# Altium project UperMachine_PCB_Project.PrjPcb
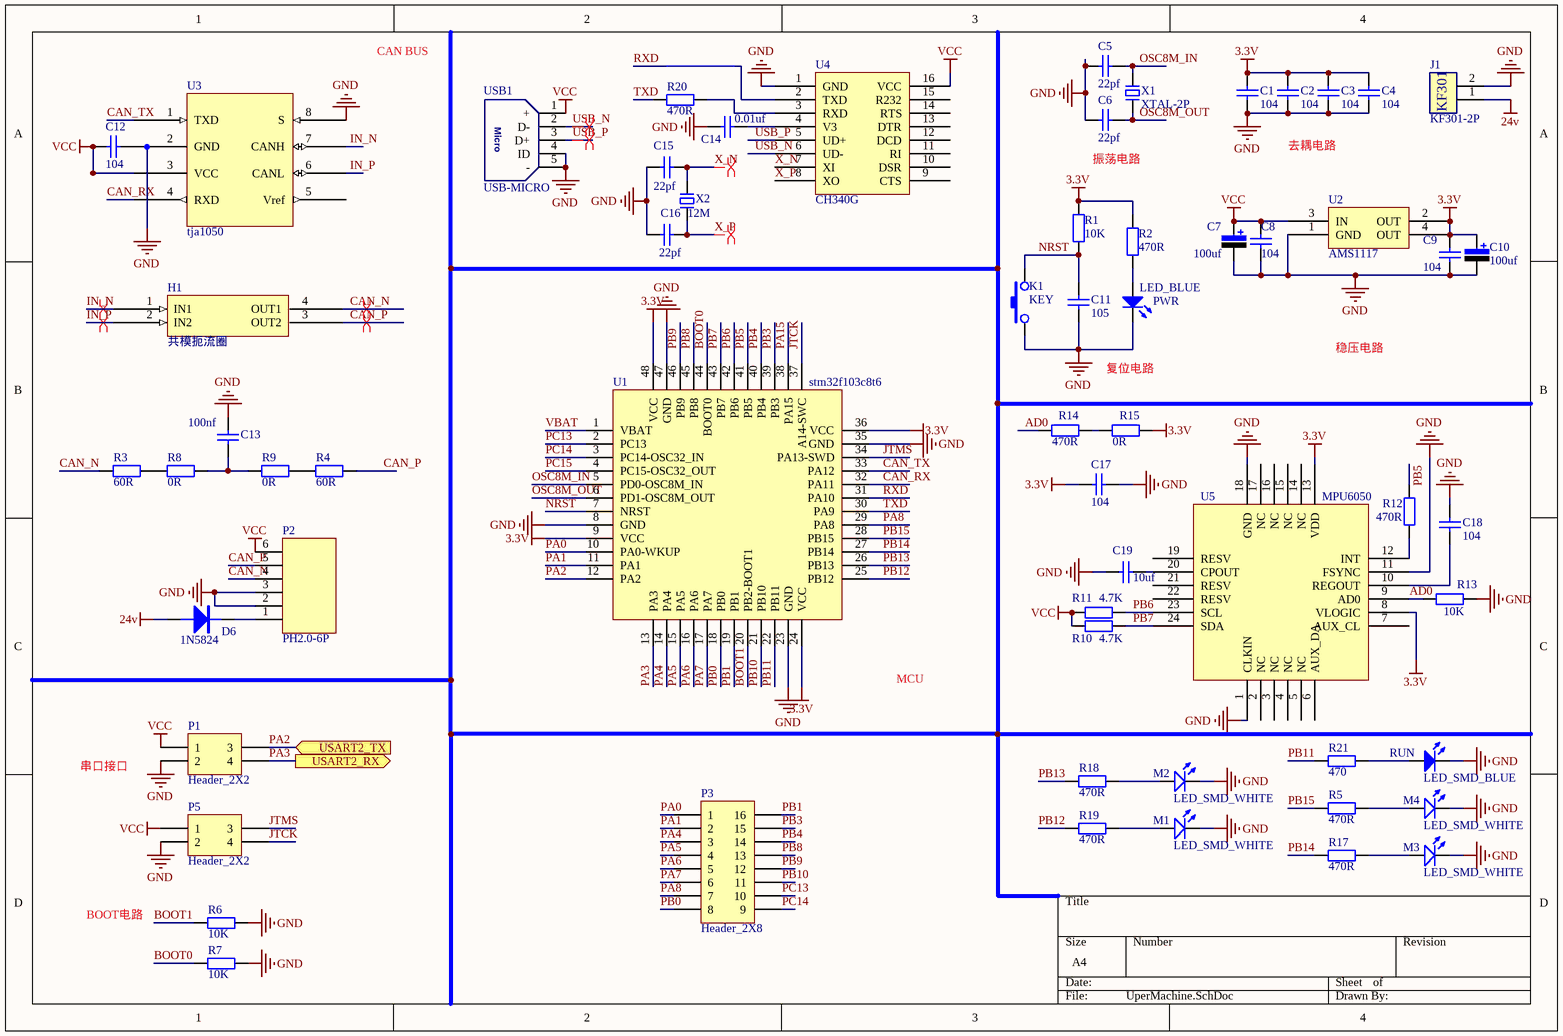
[diagram p0: UperMachine.SchDoc]
1 sheet, 61 parts. Net scope: flat (ports and power ports of the same name join across sheets).
Board file: UperMachine.PcbDoc

## Sheet UperMachine.SchDoc
size A4

### Parts
C1  104  [Cap-0603]
C2  104  [Cap-0603]
C3  104  [Cap-0603]
C4  104  [Cap-0603]
C5  22pf  [Cap-0603]
C6  22pf  [Cap-0603]
C7  100uf  [tan_cap_C]
C8  104  [Cap-0603-M]
C9  104  [Cap-0603-M]
C10  100uf  [tan_cap_C]
C11  105  [Cap-0603]
C12  104  [Cap-0603]
C13  100nf  [Cap-0603]
C14  0.01uf  [Cap-0603]
C15  22pf  [Cap-0603]
C16  22pf  [Cap-0603]
C17  104  [Cap-0603]
C18  104  [Cap-0603]
C19  10uf  [Cap-0603]
D6  1N5824  [DO-214AC/SMA]
H1  共模扼流圈  [共模扼流圈]
J1  KF301-2P  [KF301-5.0-2P]
K1  KEY  [SW-SMD-2X4]
M1  LED_SMD_WHITE  [LED_0603_W]
M2  LED_SMD_WHITE  [LED_0603_W]
M3  LED_SMD_WHITE  [LED_0603_W]
M4  LED_SMD_WHITE  [LED_0603_W]
P1  Header_2X2  [Header_SMD_2.54X2]
P2  PH2.0-6P  [PH2.0S-6P]
P3  Header_2X8  [Header_SMD_2.54X8]
P5  Header_2X2  [Header_SMD_2.54X2]
PWR  LED_BLUE  [LED_0603_B]
R1  10K  [Res-0603]
R2  470R  [Res-0603]
R3  60R  [Res-0603]
R4  60R  [Res-0603]
R5  470R  [Res-0603]
R6  10K  [Res-0603]
R7  10K  [Res-0603]
R8  0R  [Res-0603]
R9  0R  [Res-0603]
R10  4.7K  [Res-0603]
R11  4.7K  [Res-0603]
R12  470R  [Res-0603]
R13  10K  [Res-0603]
R14  470R  [Res-0603]
R15  0R  [Res-0603]
R17  470R  [Res-0603]
R18  470R  [Res-0603]
R19  470R  [Res-0603]
R20  470R  [Res-0603]
R21  470  [Res-0603]
RUN  LED_SMD_BLUE  [LED_0603_B]
U1  stm32f103c8t6  [stm32f103c8t6]
U2  AMS1117  [AMS1117]
U3  tja1050  [tja1050]
U4  CH340G  [SOP127P590X265-16N]
U5  MPU6050  [QFN50P400X400X95_HS-25N]
USB1  USB-MICRO  [USB-MICRO-SMD_C]
X1  XTAL-2P  [OSC 5032-2P]
X2  12M  [OSC HC-49SMD]

### Ports
USART2_RX (out), USART2_TX (in)

### Nets
3.3V: C1.2 C2.2 C3.2 C4.2 C9.2 C10.1 C17.2 R1.1 R2.1 R15.1 U1.9(VCC) U1.24(VCC) U1.36(VCC) U1.48(VCC) U2.2(OUT) U2.4(OUT) U5.8(VLOGIC) U5.13(VDD)
24v: D6.A J1.1
GND: C1.1 C2.1 C3.1 C4.1 C5.2 C6.2 C7.2 C8.1 C9.1 C10.2 C11.1 C13.2 C14.1 C15.2 C16.2 C17.1 C18.1 C19.2 J1.2 K1.1 M1.2(K) M2.2(K) M3.2(K) M4.2(K) P1.2 P2.2 P2.3 P5.2 PWR.2(K) R6.2 R7.1 R13.1 RUN.2(K) U1.8(GND) U1.23(GND) U1.35(GND) U1.47(GND) U2.1(GND) U3.8(S) U4.1(GND) U5.1(CLKIN) U5.11(FSYNC) U5.18(GND) USB1.4(ID) USB1.5(-)
VCC: C7.1 C8.2 C12.1 P1.1 P2.6 P5.1 R10.2 R11.2 U2.3(IN) U3.3(VCC) U4.16(VCC) USB1.1(+)
AD0: R13.2 R14.2 U5.9(AD0)
BOOT0: R7.2 U1.44(BOOT0)
BOOT1: R6.1 U1.20(PB2-BOOT1)
CAN_N: H1.4(OUT1) P2.4 R3.1
CAN_P: H1.3(OUT2) P2.5 R4.2
CAN_RX: U1.32(PA11) U3.4(RXD)
CAN_TX: U1.33(PA12) U3.1(TXD)
IN_N: H1.1(IN1) U3.7(CANH)
IN_P: H1.2(IN2) U3.6(CANL)
JTCK: P5.4 U1.37(A14-SWC)
JTMS: P5.3 U1.34(PA13-SWD)
NRST: C11.2 K1.3 R1.2 U1.7(NRST)
OSC8M_IN: C5.1 U1.5(PD0-OSC8M_IN) X1.2
OSC8M_OUT: C6.1 U1.6(PD1-OSC8M_OUT) X1.1
PA0: P3.1 U1.10(PA0-WKUP)
PA1: P3.2 U1.11(PA1)
PA2: P1.3 U1.12(PA2) ; port USART2_TX
PA3: P1.4 U1.13(PA3) ; port USART2_RX
PA4: P3.3 U1.14(PA4)
PA5: P3.4 U1.15(PA5)
PA6: P3.5 U1.16(PA6)
PA7: P3.6 U1.17(PA7)
PA8: P3.7 U1.29(PA8)
PA15: U1.38(PA15)
PB0: P3.8 U1.18(PB0)
PB1: P3.16 U1.19(PB1)
PB3: P3.15 U1.39(PB3)
PB4: P3.14 U1.40(PB4)
PB5: R12.1 U1.41(PB5)
PB6: R11.1 U1.42(PB6) U5.23(SCL)
PB7: R10.1 U1.43(PB7) U5.24(SDA)
PB8: P3.13 U1.45(PB8)
PB9: P3.12 U1.46(PB9)
PB10: P3.11 U1.21(PB10)
PB11: R21.1 U1.22(PB11)
PB12: R19.1 U1.25(PB12)
PB13: R18.1 U1.26(PB13)
PB14: R17.1 U1.27(PB14)
PB15: R5.1 U1.28(PB15)
PC13: P3.10 U1.2(PC13)
PC14: P3.9 U1.3(PC14-OSC32_IN)
PC15: U1.4(PC15-OSC32_OUT)
RXD: U1.31(PA10) U4.2(TXD)
TXD: R20.1 U1.30(PA9)
USB_N: U4.6(UD-) USB1.2(D-)
USB_P: U4.5(UD+) USB1.3(D+)
VBAT: U1.1(VBAT)
X_N: C15.1 U4.7(XI) X2.1
X_P: C16.1 U4.8(XO) X2.2
NetC12_2: C12.2 U3.2(GND)
NetC13_1: C13.1 R8.2 R9.1
NetC14_2: C14.2 U4.4(V3)
NetC18_2: C18.2 U5.10(REGOUT)
NetC19_1: C19.1 U5.20(CPOUT)
NetD6_K: D6.K P2.1
NetM1_1: M1.1(A) R19.2
NetM2_1: M2.1(A) R18.2
NetM3_1: M3.1(A) R17.2
NetM4_1: M4.1(A) R5.2
NetPWR_1: PWR.1(A) R2.2
NetR3_2: R3.2 R8.1
NetR4_1: R4.1 R9.2
NetR12_2: R12.2 U5.12(INT)
NetR14_1: R14.1 R15.2
NetR20_2: R20.2 U4.3(RXD)
NetR21_2: R21.2 RUN.1(A)

Not connected (* = marked no-connect by the designer): U3 5(Vref); U4 9(CTS) 10(DSR) 11(RI) 12(DCD) 13(DTR) 14(RTS) 15(R232); U5 2(NC) 3(NC) 4(NC) 5(NC) 6(AUX_DA) 7(AUX_CL) 14(NC) 15(NC) 16(NC) 17(NC) 19(RESV) 21(RESV) 22(RESV)

### Layout directives
differential pair: CAN_N, CAN_P, IN_N, IN_P, USB_N, USB_P, X_N, X_P

### Notes on the sheet
- CAN BUS
- 振荡电路
- 去耦电路
- 复位电路
- 稳压电路
- MCU
- 串口接口
- BOOT电路
- (in symbol KF301-2P) KF301
- (in symbol USB-MICRO) Micro

### Library data of the parts
C1-C6 C8 C9 C11-C13 C15-C19 = CAP
C7 C10 = tan_cap
C14 = Cap
D6 = DIODE: 普通二极管
M1-M4 = LED_SMD_WHITE: 发光二极管; ComponentLink1Description: 供应商链接; ComponentLink1URL: http://www.szlcsc.com/product/details_2663.html; Package: 0603; Supplier: LC; SuppliersPartNumber: C2290
PWR RUN = LED_SMD_BLUE: 发光二极管; ComponentLink1Description: 供应商链接; ComponentLink1URL: http://www.szlcsc.com/product/details_73150.html; Package: 0603; Supplier: LC; SuppliersPartNumber: C72041
R1-R15 R17-R21 = RES: 贴片电阻
X1 X2 = XTAL-2P: 2脚无源脚晶振